# Altium schematic sheet Sheet2.SchDoc
size A2; CompanyName: Contact Line; DrawnBy: A.Grigoriev; Organization: SAMSONIX; Address1: Hamerkava 19; Address3: HOLON; Address4: ISRAEL
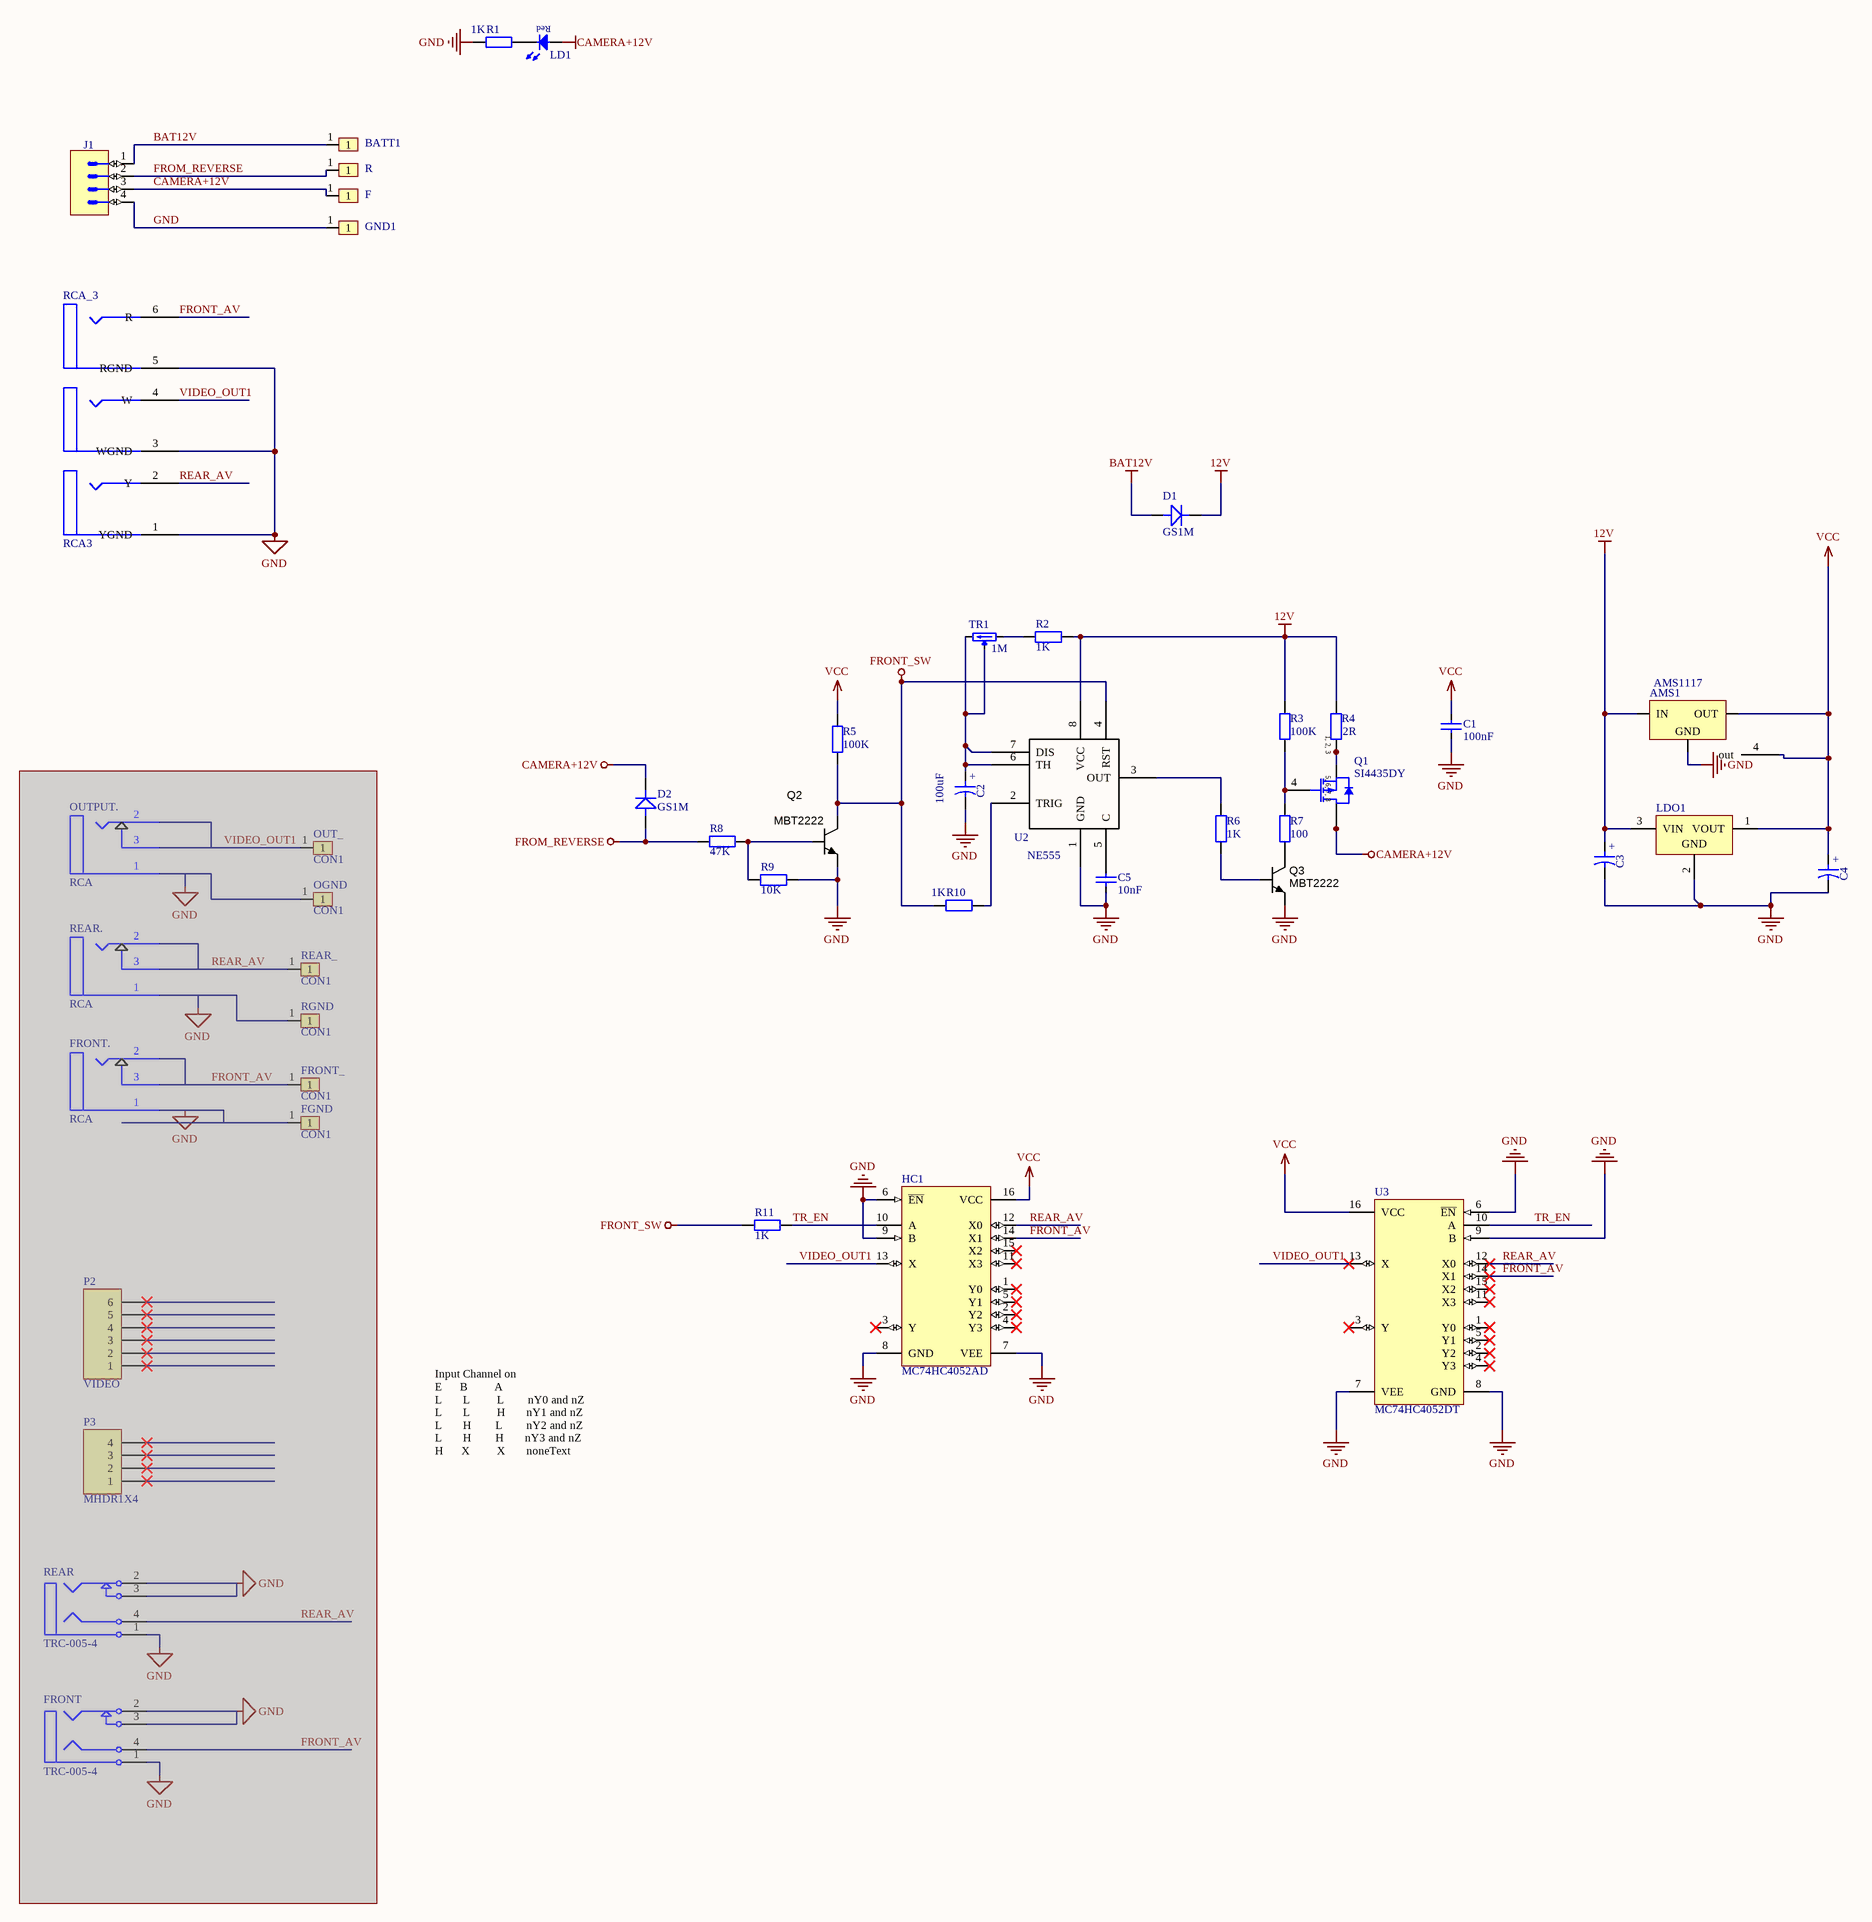
[diagram p0: Sheet2.SchDoc]

## Parts
AMS1  AMS1117  [SOT223-3]
BATT1  CON1  [J_1]  (value not drawn)
C1  value 100nF  [CAP_0805]  (hidden comment: Cap_0805)
C2  100uF  [CAPPR350-850X800]
C3  10uF  [CAPPR250-680X600]  (value not drawn)
C4  10uF  [CAPPR250-680X600]  (value not drawn)
C5  value 10nF  [CAP_0805]  (hidden comment: Cap_0805)
D1  GS1M  [DO214AA]
D2  GS1M  [DO214AA]
F  CON1  [J_1]  (value not drawn)
FGND  CON1  [J_1]  (masked out: inside a compile mask, not in the netlist)
FRONT  TRC-005-4  [TKID-TRC-005-04_V]  (masked out: inside a compile mask, not in the netlist)
FRONT.  RCA  [RCA]  (masked out: inside a compile mask, not in the netlist)
FRONT_  CON1  [J_1]  (masked out: inside a compile mask, not in the netlist)
GND1  CON1  [J_1]  (value not drawn)
HC1  MC74HC4052AD  [751B-05_N]
J1  (no value)  [PHOENIX_1757268]
LD1  Red  [LED_AVAGO_HSMC-C110]  (value not drawn)
LDO1  L78L05ABUTR  [SOT-89_N]  (value not drawn)
OGND  CON1  [J_1]  (masked out: inside a compile mask, not in the netlist)
OUT_  CON1  [J_1]  (masked out: inside a compile mask, not in the netlist)
OUTPUT.  RCA  [RCA]  (masked out: inside a compile mask, not in the netlist)
P2  VIDEO  [MHDR1X6]  (masked out: inside a compile mask, not in the netlist)
P3  MHDR1X4  [MHDR1X4]  (masked out: inside a compile mask, not in the netlist)
Q1  SI4435DY  [SO-8_N]
Q2  MBT2222  [SOT23-3]
Q3  MBT2222  [SOT23-3]
R  CON1  [J_1]  (value not drawn)
R1  1K  [RES_0805]
R2  1K  [RES_0805]
R3  100K  [RES_0805]
R4  2R  [RES_0805]
R5  100K  [RES_0805]
R6  1K  [RES_0805]
R7  100  [RES_0805]
R8  47K  [RES_0805]
R9  10K  [RES_0805]
R10  1K  [RES_0805]
R11  1K  [RES_0805]
RCA_3  RCA3  [RCAX3]
REAR  TRC-005-4  [TKID-TRC-005-04_V]  (masked out: inside a compile mask, not in the netlist)
REAR.  RCA  [RCA]  (masked out: inside a compile mask, not in the netlist)
REAR_  CON1  [J_1]  (masked out: inside a compile mask, not in the netlist)
RGND  CON1  [J_1]  (masked out: inside a compile mask, not in the netlist)
TR1  1M  [TRIM_BOURNS_3296Y]
U2  NE555  [SO8]
U3  MC74HC4052DT  [948F-01_N]

## Nets
12V: AMS1.3(IN) C3.1 D1.2 LDO1.3(VIN) R2.2 R3.1 R4.2 U2.8(VCC)
BAT12V: BATT1.1 D1.1 J1.1
CAMERA+12V: D2.2 F.1 J1.3 LD1.2(A) Q1.5(D) Q1.6(D) Q1.7(D) Q1.8(D)
FROM_REVERSE: D2.1 J1.2 R.1 R8.1
FRONT_SW: Q2.3(C) R5.1 R10.1 R11.1 U2.4(RST)
GND: AMS1.1(GND) C1.1 C2.2 C3.2 C4.2 C5.1 GND1.1 HC1.6(~{EN}) HC1.7(VEE) HC1.8(GND) HC1.9(B) J1.4 LDO1.2(GND) Q2.2(E) Q3.2(E) R1.1 R9.1 RCA_3.1(YGND) RCA_3.3(WGND) RCA_3.5(RGND) U2.1(GND) U3.6(~{EN}) U3.7(VEE) U3.8(GND) U3.9(B)
VCC: AMS1.2(OUT) AMS1.4(out) C1.2 C4.1 HC1.16(VCC) LDO1.1(VOUT) R5.2 U3.16(VCC)
FRONT_AV: HC1.14(X1) RCA_3.6(R) U3.14(X1)
REAR_AV: HC1.12(X0) RCA_3.2(Y) U3.12(X0)
TR_EN: HC1.10(A) R11.2 U3.10(A)
VIDEO_OUT1: HC1.13(X) RCA_3.4(W) U3.13(X)
NetC2_1: C2.1 TR1.2(W) TR1.3(CW) U2.6(TH) U2.7(DIS)
NetC5_2: C5.2 U2.5(C)
NetLD1_1: LD1.1(C) R1.2
NetQ1_1: Q1.1(S) Q1.2(S) Q1.3(S) R4.1
NetQ1_4: Q1.4(G) R3.2 R7.2
NetQ2_1: Q2.1(B) R8.2 R9.2
NetQ3_1: Q3.1(B) R6.1
NetQ3_3: Q3.3(C) R7.1
NetR2_1: R2.1 TR1.1(CCW)
NetR6_2: R6.2 U2.3(OUT)
NetR10_2: R10.2 U2.2(TRIG)

Not connected (* = marked no-connect by the designer): HC1 1(Y0)* 2(Y2)* 3(Y)* 4(Y3)* 5(Y1)* 11(X3)* 15(X2)*; U3 1(Y0)* 2(Y2)* 3(Y)* 4(Y3)* 5(Y1)* 11(X3)* 15(X2)*

## Notes on the sheet
- Input Channel on
  E      B         A
  L       L         L        nY0 and nZ
  L       L         H       nY1 and nZ
  L       H        L        nY2 and nZ
  L       H        H       nY3 and nZ
  H      X         X       noneText
- Title
- Size:
- Date:
- A3
- Number:
- Time:
- Revision:
- Sheet
- of
- File:
- (in symbol CAER_10UF_25V_20%_250-680X780_LESR0R055) +
- (in symbol CAER_100UF_25V_20%_RUBYCON_25ML100M8X7) +
- (in symbol SI4435DY) 1, 2, 3; 5, 6, 7, 8

## Library data of the parts
AMS1 = AMS1117: Power
BATT1 F FGND FRONT_ GND1 OGND OUT_ R REAR_ RGND = CON1: Упаковка: туб лента поддон; SMD_DIP: SMD_DIP; Корпус: *
C1 C5 = Cap_0805: Capacitor
  C1: Supplier 1: Mouser; Supplier Part Number 1: 80-C0805C104K3R
  C5: Supplier 1: Farnell; Supplier Part Number 1: 2280935
C2 = CAER_100UF_25V_20%_RUBYCON_25ML100M8X7: Polarised capacitor; Part Description: Aluminum Electrolytic Capacitor, (ML Series); Voltage: 25V; Tolerance: ±20%; Table: Capacitors THD; Part Number: CAER_100UF_25V_20%_RUBYCON_25ML100M8X7; Component Kind: Standard; Component Type: Standard; Pin Count: 2; Value: 100uF; Status: None; Manufacturer: RUBYCON; Manufacturer Part Number: 25ML100M8X7; Case: LS3.5 D8.5 x H8; Mounted: Yes; Socket: No; SMD: No; ComponentHeight: 8mm; HelpURL: \\cern.ch\dfs\Applications\Altium\Datasheets\CAER_RUBYCON_25ML100M8X7.pdf; Author: CERN DEM JMW; CreateDate: 17/11/2008; LatestRevisionDate: 08/05/2013
C3 C4 = CAER_10UF_25V_20%_250-680X780_LESR0R055: Polarised capacitor; Part Description: Low ESR 0R055 Aluminum Solid Capacitor With Organic Semiconductive Electrolyte; Manufacturer: SANYO OS-CON; Manufacturer Part Number: 25SP10M; Voltage: 25V; Tolerance: ±20%; Table: Capacitors THD; Part Number: CAER_10UF_25V_20%_250-680X780_LESR0R055; Component Kind: Standard; Component Type: Standard; Pin Count: 2; Value: 10uF; Status: Preferred; Case: LS2.5 D6.8 x H6; Mounted: Yes; Socket: No; SMD: No; ComponentHeight: 6mm; HelpURL: \\cern.ch\dfs\Applications\Altium\Datasheets\CAER-LESR_SANYO_SP.pdf; Author: CERN DEM JLC; CreateDate: 1/29/2008; LatestRevisionDate: 6/17/2010
D1 D2 = DIOD GS1M: SMD диод; Корпус: DO214AA (SMA); Упаковка: лента; Поставщик: Temys; SMD_DIP: SMD; PartNumber: GS1M; DataSheet: www.datasheetcatalog.org/datasheet/jgd/GS1D.pdf
FRONT REAR = CMP-0443-00001-1: Connector, TRC-005-4 , Black RCA Phono Jack, Right Angle, Through Hole, Snap-In; Manufacturer: Technik Industrial; Mounting Technology: Through Hole; ComponentLink1Description: Manufacturer URL; ComponentLink1URL: http://www.technik.com.hk/; ComponentLink2URL: http://www.technik.com.hk/images/pdf_product/RC005-PBT-C.pdf; PackageDescription: RCA Phono Jack, Right Angle, Through-Hole, Body 20.8x9.8mm; PartNumber: TRC-005-4; DatasheetVersion: Aug-08; ComponentLink2Description: Datasheet; PackageReference: TRC-005-4
HC1 = MC74HC4052AD: Analog Multiplexer/Demultiplexer; Published: 17-Jul-2002; LatestRevisionDate: 13-Apr-2006; LatestRevisionNote: IPC-7351 Footprint Added.; DatasheetVersion: Mar-2000; PackageVersion: May-1997; PackageReference: 751B-05; Publisher: Altium Limited; PackageDescription: 16-Pin Small Outline Integrated Circuit 1.27 mm Pitch; Code_JEDEC: MS-012-AC; Code_IPC: SOIC127P600-16; ComponentLink1Description: Manufacturer Link; ComponentLink1URL: http://www.onsemi.com/site/products/parametrics/0,4446,47,00.html; ComponentLink2Description: Datasheet; ComponentLink2URL: http://www.onsemi.com/pub/Collateral/MC74HC4051A-D.PDF; Supplier 1: Farnell; Supplier Part Number 1: 1201328
J1 = PHOENIX_1757268: Connector 4 Male; Part Description: 12A, 250V, Pitch 5.08mm, 4 Positions Header; Manufacturer: PHOENIX CONTACT; Manufacturer Part Number: 1757268 (MSTBA 2,5/ 4-G-5,08); Part Number: PHOENIX_1757268; Component Kind: Standard; Component Type: Standard; Pin Count: 4; Mounted: Yes; Socket: No; SMD: No; Status: None; ComponentHeight: 8.6mm; HelpURL: \\cern.ch\dfs\Applications\Altium\Datasheets\PHOENIX_1757268.pdf; Author: CERN DEM JLC; CreateDate: 2/10/2010; LatestRevisionDate: 4/26/2010; Table: PHOENIX
LD1 = LED_AVAGO_HSMC-C110: LED Red 1C 2A; Part Description: High Performance Right Angle Chip Red LED; Manufacturer: AVAGO TECHNOLOGIES; Table: LEDs & Displays; Part Number: LED_AVAGO_HSMC-C110; Component Kind: Standard; Component Type: Standard; Color: Red; PackageDescription: Red Chip LED, 2-Leads, Body 3.3x1.6mm, Side Emitting Package; Manufacturer Part Number: HSMC-C110; Pin Count: 2; Mounted: Yes; Socket: No; SMD: Yes; ComponentHeight: 1.1mm; HelpURL: \\cern.ch\dfs\Applications\Altium\Datasheets\LED_AVAGO_HSMC-C110.pdf; ComponentLink1URL: \\cern.ch\dfs\Applications\Altium\Datasheets\LED_AVAGO_HSMC-C110_DESIGN-GUIDE.pdf; ComponentLink1Description: Design Guide; Author: CERN DEM JMW; CreateDate: 30/07/2009; LatestRevisionDate: 20/06/2012; Supplier 1: Mouser; Supplier Part Number 1: 630-HSMC-C110
LDO1 = L78L05ABUTR: Positive Voltage Regulator, 5V, 4-Pin SOT-89, Tape and Reel; DatasheetVersion: Feb-2011; PackageVersion: 2011; PackageReference: SOT-89; PackageDescription: 3-Pin SOT-89 Package 1.5 mm Pitch, 4.1 mm Lead Span; PartNumber: L78L05ABUTR; ComponentLink1Description: Manufacturer URL; ComponentLink1URL: http://www.st.com; ComponentLink2Description: Datasheet; ComponentLink2URL: http://www.st.com/internet/com/TECHNICAL_RESOURCES/TECHNICAL_LITERATURE/DATASHEET/CD00000446.pdf; Supplier 1: Newark; Supplier Part Number 1: 31Y2531
P2 = MHDR1X6: Header, 6-Pin; LatestRevisionDate: 17-Jul-2002; LatestRevisionNote: Re-released for DXP Platform.; Publisher: Altium Limited
P3 = MHDR1X4: Header, 4-Pin; LatestRevisionDate: 17-Jul-2002; LatestRevisionNote: Re-released for DXP Platform.; Publisher: Altium Limited
Q1 = SI4435DY: P-Channel 30V (D-S) Rated  MOSFET; Published: 8-Jun-2000; LatestRevisionDate: 13-Apr-2006; LatestRevisionNote: IPC-7351 Footprint Added.; DatasheetVersion: 6-Oct-1997; PackageVersion: Aug-1998; PackageReference: SO-8; Publisher: Altium Limited; PackageDescription: 8-Pin Small Outline Integrated Circuit 1.27 mm Pitch; ComponentLink1Description: Manufacturer Link; ComponentLink1URL: http://www.vishay.com/; ComponentLink2Description: Datasheet; ComponentLink2URL: http://www.vishay.com/docs/70149/70149.pdf; Supplier 1: Mouser; Supplier Part Number 1: 942-SI4435DYPBF
Q2 Q3 = NPN_MMBT2222A: Transistor SMD NPN 40V 600mA 250mW SOT23-3; Manufacturer 1: Fairchild Semiconductor; Ratings: 40V; 600mA; 250mW; Material: Si; SCDType: source; Package / Case: SOT-23; Mounting Type: Surface Mount; Supplier 1: Digi-Key; Supplier Part Number 1: MMBT2222AFSTR-ND; Manufacturer 2: NXP Semiconductors; Manufacturer Part Number 2: MMBT2222A; Manufacturer Part Number 1: MMBT2222A; Supplier 2: Digi-Key; Supplier Part Number 2: 568-4509-2-ND; Value: MBT2222
R1-R11 = Res_0805: Resistor
  R1 R6 R10: Value: 1K; Supplier 1: Allied; Supplier Part Number 1: 70484573
  R2: Value: 1K; Supplier 1: Allied; Supplier Part Number 1: 70154698
  R3 R5: Value: 100K; Supplier 1: Allied; Supplier Part Number 1: 70154698
  R4: Value: 2R
  R7: Value: 100; Supplier 1: Newark; Supplier Part Number 1: 58K4710
  R8: Value: 47K; Supplier 1: Allied; Supplier Part Number 1: 70264867
  R9: Value: 10K; Supplier 1: Allied; Supplier Part Number 1: 70264867
  R11: Value: 1K; Supplier 1: Allied; Supplier Part Number 1: 70264867
RCA_3 = Component_1
TR1 = TRIM_25T_1M_BOURNS_3296Y-1-105LF: Trimming Potentiometer; Part Description: 25 Turn Trimming Potentiometer (Top Adjustement); Manufacturer: BOURNS; Power: 0.5W; TC: ±100ppm/°C; Tolerance: ±10%; Table: Potentiometers THD; Part Number: TRIM_25T_1M_BOURNS_3296Y-1-105LF; Component Kind: Standard; Component Type: Standard; Pin Count: 3; Value: 1M; Manufacturer Part Number: 3296Y-1-105LF; Case: 3296Y; Mounted: Yes; Socket: No; SMD: No; ComponentHeight: 11.55mm; HelpURL: \\cern.ch\dfs\Applications\Altium\Datasheets\TRIM_BOURNS_3296Y.pdf; Author: CERN DEM JLC; CreateDate: 20/10/2008; LatestRevisionDate: 28/11/2012; Supplier 1: Digi-Key; Supplier Part Number 1: 3296W-105LF-ND; Supplier 2: TME; Supplier Part Number 2: 3296Y-1-105LF; Supplier 3: Mouser; Supplier Part Number 3: 652-3296Y-1-105; Supplier 4: Arrow; Supplier Part Number 4: ggKPwAKS2sB7yfOEZhzQbC3wJOBqSkwgVY0iHxrkrLU; Supplier 5: Digi-Key; Supplier Part Number 5: 3296Y-105LF-ND; Supplier 6: Farnell; Supplier Part Number 6: 1141425; Supplier 7: Mouser; Supplier Part Number 7: 652-3296Y-1-105LF; Supplier 8: Allied; Supplier Part Number 8: 70154400; Supplier 9: Farnell; Supplier Part Number 9: 9353542
U2 = NE555: TIMER IC; Manufacturer Part Number: NE555DT; Manufacturer: STMicroelectronics; Frequency: 500kHz; Voltage - Supply: 4.5 V ~ 16 V; Current: 200mA; Supplier 1: Digi-Key; Supplier Part Number 1: 497-1962-2-ND; Supplier: Digi-Key; Category: Integrated Circuits (ICs); Supplier Part Number: 497-1962-2-ND; Package / Case: 8-SOIC (3.9mm Width); Packaging: Tape & Reel (TR); RoHS: RoHS Compliant; Operating Temperature: 0°C ~ 70°C; Count: -; Type: 555 Type, Timer/Oscillator (Single)
U3 = MC74HC4052DT: Dual 4-Channel Analog Multiplexer/Demultiplexer; Published: 15-Apr-2002; LatestRevisionDate: 12-Dec-2006; LatestRevisionNote: IPC-7351 Footprint Added.; DatasheetVersion: 1995; PackageVersion: Feb-2000; PackageReference: 948F-01; Publisher: Altium Limited; PackageDescription: 16-Pin Thin Small Outline Package 0.65 mm Pitch; ComponentLink1Description: Manufacturer Link; ComponentLink1URL: http://www.onsemi.com/; ComponentLink2Description: Datasheet; ComponentLink2URL: http://www.onsemi.com/pub/Collateral/MC74HC4051-D.PDF; Supplier 1: Allied; Supplier Part Number 1: 70466412